# EAGLE design 8CH Dimmer (EAGLE 7.5.0)
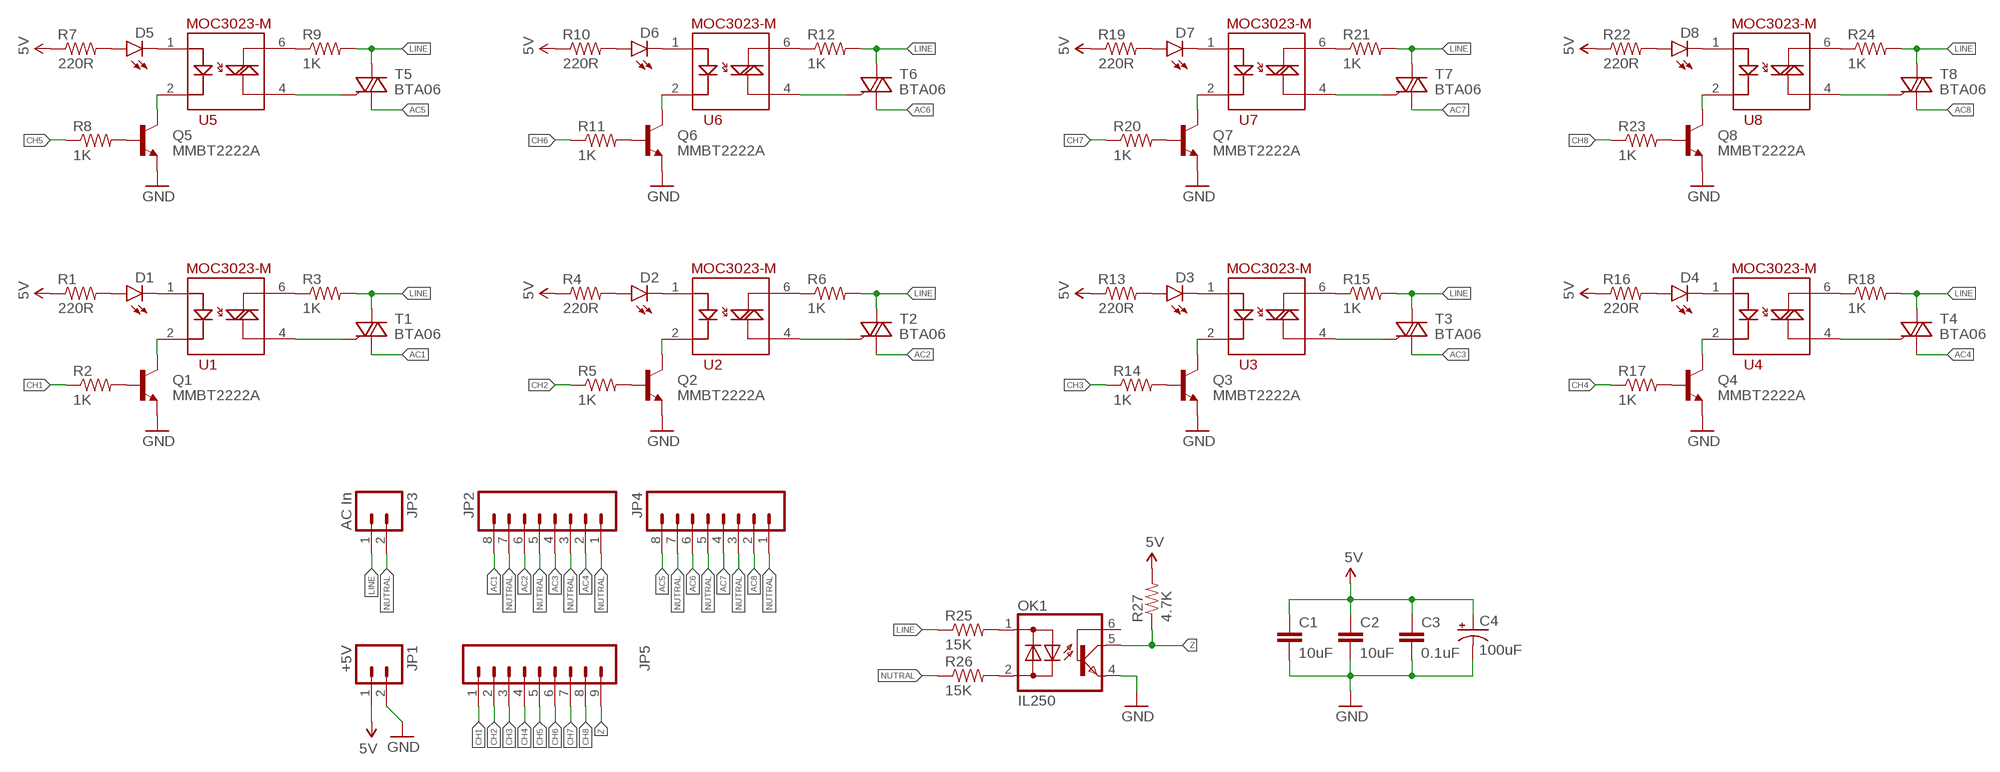
[diagram p0: schematic, sheet 1]

## Parts
C1  10uF  CAP0805  [0805]
C2  10uF  CAP0805  [0805]
C3  0.1uF  CAP0805  [0805]
C4  100uF  CPOL-USE2.5-5  [E2,5-5]
D1  LED3MM  [LED3MM]
D2  LED3MM  [LED3MM]
D3  LED3MM  [LED3MM]
D4  LED3MM  [LED3MM]
D5  LED3MM  [LED3MM]
D6  LED3MM  [LED3MM]
D7  LED3MM  [LED3MM]
D8  LED3MM  [LED3MM]
JP1  +5V  M023.5MM  [SCREWTERMINAL-3.5MM-2]
JP2  M083.5MM-8  [SCREWTERMINAL-3.5MM-8]
JP3  AC In  M023.5MM  [SCREWTERMINAL-3.5MM-2]
JP4  M083.5MM-8  [SCREWTERMINAL-3.5MM-8]
JP5  M09  [1X09]
OK1  IL250  [DIL06]
Q1  MMBT2222A  TRANSISTOR_NPNMMBT2222A  [SOT23-3]
Q2  MMBT2222A  TRANSISTOR_NPNMMBT2222A  [SOT23-3]
Q3  MMBT2222A  TRANSISTOR_NPNMMBT2222A  [SOT23-3]
Q4  MMBT2222A  TRANSISTOR_NPNMMBT2222A  [SOT23-3]
Q5  MMBT2222A  TRANSISTOR_NPNMMBT2222A  [SOT23-3]
Q6  MMBT2222A  TRANSISTOR_NPNMMBT2222A  [SOT23-3]
Q7  MMBT2222A  TRANSISTOR_NPNMMBT2222A  [SOT23-3]
Q8  MMBT2222A  TRANSISTOR_NPNMMBT2222A  [SOT23-3]
R1  220R  RESISTOR0805-RES  [0805]
R2  1K  RESISTOR0805-RES  [0805]
R3  1K  RESISTORPTH-1/2W  [AXIAL-0.5]
R4  220R  RESISTOR0805-RES  [0805]
R5  1K  RESISTOR0805-RES  [0805]
R6  1K  RESISTORPTH-1/2W  [AXIAL-0.5]
R7  220R  RESISTOR0805-RES  [0805]
R8  1K  RESISTOR0805-RES  [0805]
R9  1K  RESISTORPTH-1/2W  [AXIAL-0.5]
R10  220R  RESISTOR0805-RES  [0805]
R11  1K  RESISTOR0805-RES  [0805]
R12  1K  RESISTORPTH-1/2W  [AXIAL-0.5]
R13  220R  RESISTOR0805-RES  [0805]
R14  1K  RESISTOR0805-RES  [0805]
R15  1K  RESISTORPTH-1/2W  [AXIAL-0.5]
R16  220R  RESISTOR0805-RES  [0805]
R17  1K  RESISTOR0805-RES  [0805]
R18  1K  RESISTORPTH-1/2W  [AXIAL-0.5]
R19  220R  RESISTOR0805-RES  [0805]
R20  1K  RESISTOR0805-RES  [0805]
R21  1K  RESISTORPTH-1/2W  [AXIAL-0.5]
R22  220R  RESISTOR0805-RES  [0805]
R23  1K  RESISTOR0805-RES  [0805]
R24  1K  RESISTORPTH-1/2W  [AXIAL-0.5]
R25  15K  RESISTORPTH-1/2W  [AXIAL-0.5]
R26  15K  RESISTORPTH-1/2W  [AXIAL-0.5]
R27  4.7K  RESISTOR0805-RES  [0805]
T1  BTA06  [TO220-V]
T2  BTA06  [TO220-V]
T3  BTA06  [TO220-V]
T4  BTA06  [TO220-V]
T5  BTA06  [TO220-V]
T6  BTA06  [TO220-V]
T7  BTA06  [TO220-V]
T8  BTA06  [TO220-V]
U1  MOC3023-M  MOC3031-M  [DIL06]
U2  MOC3023-M  MOC3031-M  [DIL06]
U3  MOC3023-M  MOC3031-M  [DIL06]
U4  MOC3023-M  MOC3031-M  [DIL06]
U5  MOC3023-M  MOC3031-M  [DIL06]
U6  MOC3023-M  MOC3031-M  [DIL06]
U7  MOC3023-M  MOC3031-M  [DIL06]
U8  MOC3023-M  MOC3031-M  [DIL06]

## Nets
5V: C1.1 C2.1 C3.1 C4.+ JP1.1 R1.1 R4.1 R7.1 R10.1 R13.1 R16.1 R19.1 R22.1 R27.2
AC1: JP2.8 T1.1(A1)
AC2: JP2.6 T2.1(A1)
AC3: JP2.4 T3.1(A1)
AC4: JP2.2 T4.1(A1)
AC5: JP4.8 T5.1(A1)
AC6: JP4.6 T6.1(A1)
AC7: JP4.4 T7.1(A1)
AC8: JP4.2 T8.1(A1)
CH1: JP5.1 R2.1
CH2: JP5.2 R5.1
CH3: JP5.3 R14.1
CH4: JP5.4 R17.1
CH5: JP5.5 R8.1
CH6: JP5.6 R11.1
CH7: JP5.7 R20.1
CH8: JP5.8 R23.1
GND: C1.2 C2.2 C3.2 C4.- JP1.2 OK1.4(E) Q1.2(E) Q2.2(E) Q3.2(E) Q4.2(E) Q5.2(E) Q6.2(E) Q7.2(E) Q8.2(E)
LINE: JP3.1 R3.P$2 R6.P$2 R9.P$2 R12.P$2 R15.P$2 R18.P$2 R21.P$2 R24.P$2 R25.P$1 T1.2(A2) T2.2(A2) T3.2(A2) T4.2(A2) T5.2(A2) T6.2(A2) T7.2(A2) T8.2(A2)
N$1: D1.K(C) U1.1
N$2: D1.A R1.2
N$3: Q1.1(B) R2.2
N$4: T1.3(G) U1.4
N$5: Q1.3(C) U1.2
N$6: R3.P$1 U1.6
N$7: Q2.1(B) R5.2
N$8: T2.3(G) U2.4
N$9: R6.P$1 U2.6
N$10: Q2.3(C) U2.2
N$11: D2.K(C) U2.1
N$12: D2.A R4.2
N$13: Q5.1(B) R8.2
N$14: T5.3(G) U5.4
N$15: R9.P$1 U5.6
N$16: Q5.3(C) U5.2
N$17: D5.K(C) U5.1
N$18: D5.A R7.2
N$19: Q6.1(B) R11.2
N$20: T6.3(G) U6.4
N$21: R12.P$1 U6.6
N$22: Q6.3(C) U6.2
N$23: D6.K(C) U6.1
N$24: D6.A R10.2
N$25: Q3.1(B) R14.2
N$26: T3.3(G) U3.4
N$27: R15.P$1 U3.6
N$28: Q3.3(C) U3.2
N$29: D3.K(C) U3.1
N$30: D3.A R13.2
N$31: Q4.1(B) R17.2
N$32: T4.3(G) U4.4
N$33: R18.P$1 U4.6
N$34: Q4.3(C) U4.2
N$35: D4.K(C) U4.1
N$36: D4.A R16.2
N$37: Q7.1(B) R20.2
N$38: T7.3(G) U7.4
N$39: R21.P$1 U7.6
N$40: Q7.3(C) U7.2
N$41: D7.K(C) U7.1
N$42: D7.A R19.2
N$43: Q8.1(B) R23.2
N$44: T8.3(G) U8.4
N$45: R24.P$1 U8.6
N$46: Q8.3(C) U8.2
N$47: D8.K(C) U8.1
N$48: D8.A R22.2
N$49: OK1.1(AC1) R25.P$2
N$50: OK1.2(AC2) R26.P$2
NUTRAL: JP2.1 JP2.3 JP2.5 JP2.7 JP3.2 JP4.1 JP4.3 JP4.5 JP4.7 R26.P$1
Z: JP5.9 OK1.5(C) R27.1
Unconnected: OK1.6(B)

## Library data of the parts
C1-C3 = SparkFun-Capacitors:CAP: Capacitor Standard 0603 ceramic capacitor, and 0.1" leaded capacitor.
C4 = adafruit:CPOL-US: POLARIZED CAPACITOR, American symbol
D1-D8 = SparkFun-LED:LED: LEDs Standard schematic elements and footprints for 5mm, 3mm, 1206, and 0603 sized LEDs. 5mm - Spark Fun Electronics SKU : COM-00529 (and others)
JP1 JP3 = SparkFun-Connectors:M02: Standard 2-pin 0.1" header. Use with - straight break away headers ( PRT-00116) - right angle break away headers (PRT-00553) - swiss pins (PRT-00743) - machine pins (PRT-00117) - female headers (PRT-00115) Molex polarized connector foot print use with: PRT-08233 with associated crimp pins and housings. 2.54_SCREWTERM for use with PRT-10571. 3.5mm Screw Terminal footprints for PRT-08084 5mm Screw Terminal footprints for use with PRT-08432; PROD_ID: CONN-08399
JP2 JP4 = SparkFun-Connectors:M08: Header 8 Standard 8-pin 0.1" header. Use with straight break away headers (SKU : PRT-00116), right angle break away headers (PRT-00553), swiss pins (PRT-00743), machine pins (PRT-00117), and female headers (PRT-00115).
JP5 = SparkFun-Connectors:M09: Header 9 Standard 9-pin 0.1" header. Use with straight break away headers (SKU : PRT-00116), right angle break away headers (PRT-00553), swiss pins (PRT-00743), machine pins (PRT-00117), and female headers (PRT-00115).
OK1 = optocoupler:IL250: SIEMENS OPTO COUPLER; MF: VISHAY/TELEFUNKEN; MPN: IL250; OC_FARNELL: 1469559; OC_NEWARK: 58K1705
Q1-Q8 = SparkFun-DiscreteSemi:TRANSISTOR_NPN: Generic NPN BJT MMBT2222A - TRANS-08049 (SOT-23, 1A 40V) MPSA42 - TRANS-09116 (SOT-23, 500mA 300V) MMBT5088LT1G - TRANS-11160 (SOT-23, 50 mA 30V) BC547 - COM-08928 <http://www.sparkfun.com/products/8928> (TO-92 45V 100mA) (1.Collector 2.Base 3.Emitter) 2N3904 - COM-00521 <http://www.sparkfun.com/products/521> (TO-92 40V 200mA) (1.Emitter 2.Base 3.Collector) P2N2222A - COM-12852 <http://www.sparkfun.com/products/12852> (TO-92 40V 600mA) (1.Collector 2.Base 3.Emitter); PROD_ID: TRANS-08049
R1-R27 = SparkFun-Resistors:RESISTOR: Resistor Basic schematic elements and footprints for 0603, 1206, and PTH resistors.
T1-T8 = spaelectronics:BTA06
U1-U8 = SparkFun-DiscreteSemi:MOC3031-M: Opto-isolated TRIAC

## Board
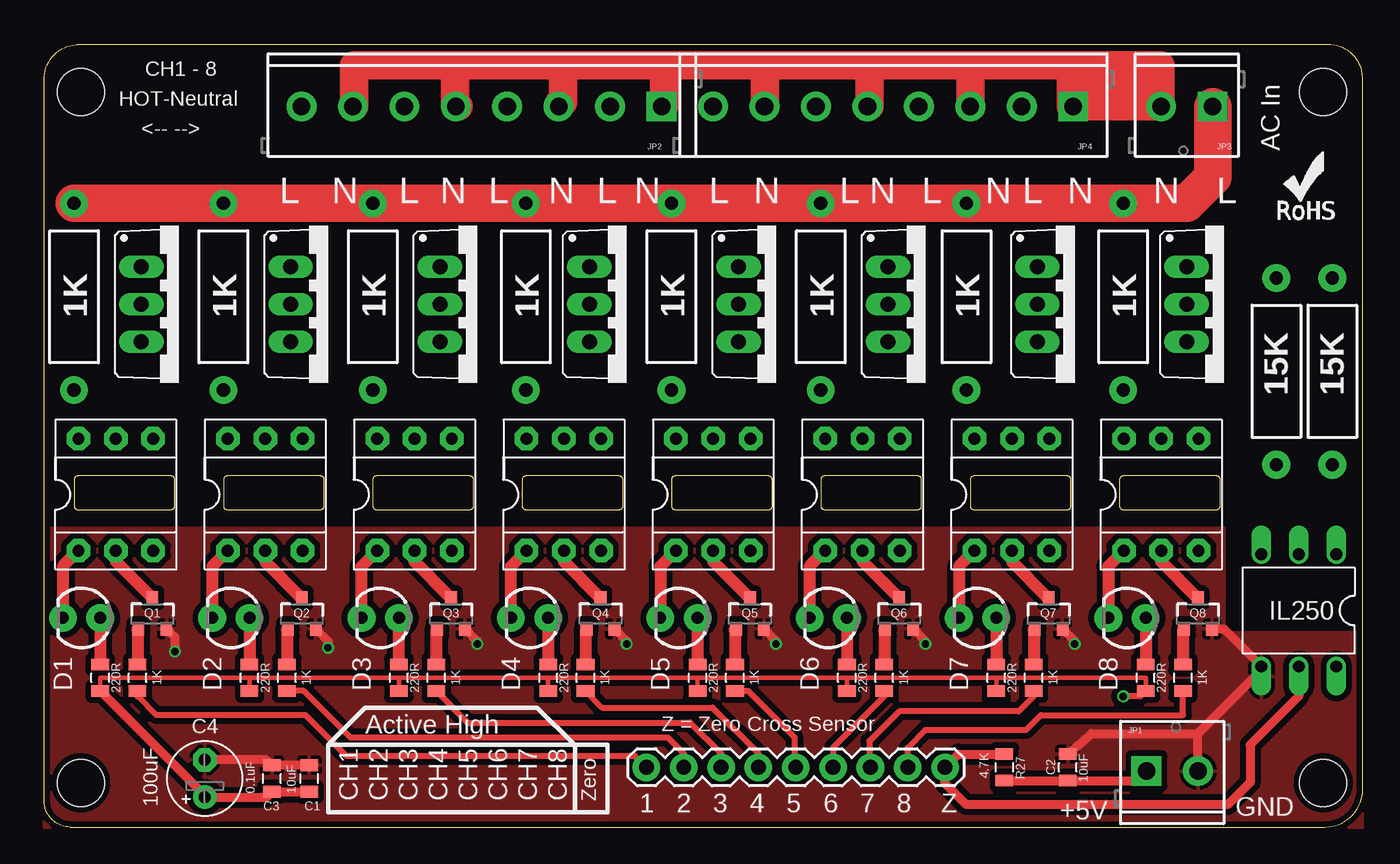
[diagram p1: board, top side]
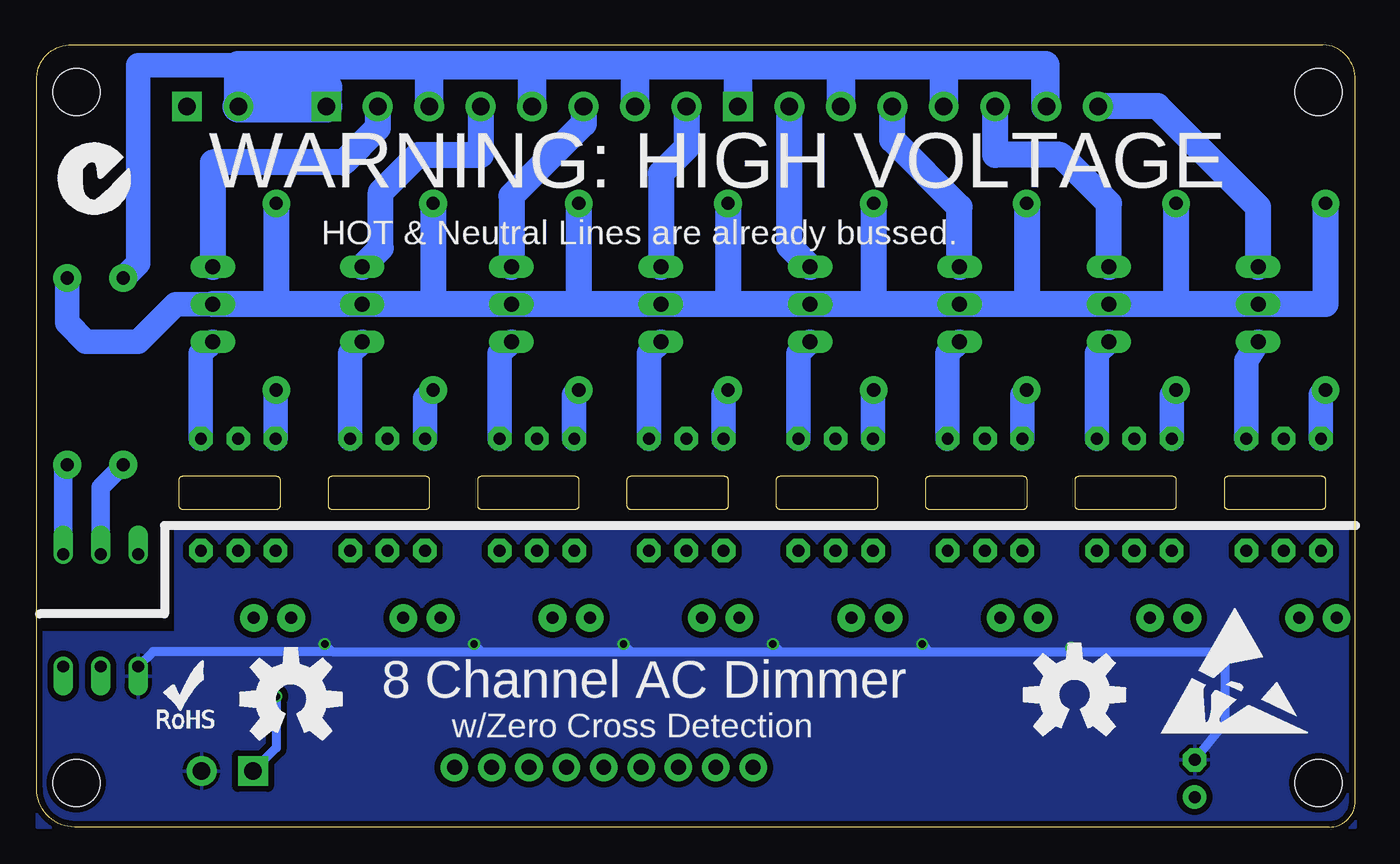
[diagram p2: board, bottom side, seen from below]

Size 89.7 x 53.2 mm. Coordinates in mm from the lower left corner, seen from the top.
Outline: 1.78,0 87.1,0 arc90 89.7,2.6 89.7,51 arc90 87.3,53.2 2.2,53.2 arc90 0,50.8 0,1.78 arc90 1.78,0
Copper layers (1*16): Top 0.035mm / dielectric 1.5mm / Bottom 0.035mm
Design rules "dirt_cheap_dirty_boards.v1": minimum track width 5mil, minimum drill 12mil, track to track 5mil, track to pad 5mil, pad to pad 5mil, via to via 5mil, smd to smd 0mil, copper to edge 10mil, drill to drill 10mil, minimum pad ring 10mil, minimum via ring 6mil, stop-mask expansion 2mil, vias tented up to drill 25mil, thermal gap 10mil
Holes 3.2 mm at 2.5,3 2.5,50 87,50 87,3
Milling: 64 lines

### Footprints (pad centres in the part's own frame; a part is rotated, then mirrored left to right if it is on the bottom)
0805 = smd 0.8 x 1.2: 1 -0.9,0; 2 0.9,0
E2,5-5 = drill 0.813 pad 1.6: + -1.27,0 | drill 0.813 pad 1.6 octagon: - 1.27,0
LED3MM = drill 0.813 pad 1.88: A -1.27,0; K 1.27,0
SCREWTERMINAL-3.5MM-2 = drill 1.2 pad 2.032 square: 1 0,0 | drill 1.2 pad 2.032: 2 3.5,0
SCREWTERMINAL-3.5MM-8 = drill 1.2 pad 2.032 square: 1 0,0 | drill 1.2 pad 2.032: 2 3.5,0; 3 7,0; 4 10.5,0; 5 14,0; 6 17.5,0; 7 21,0; 8 24.5,0
1X09 = drill 1.016 pad 1.88: 1 0,0; 2 2.54,0; 3 5.08,0; 4 7.62,0; 5 10.16,0; 6 12.7,0; 7 15.24,0; 8 17.78,0; 9 20.32,0
DIL06 = drill 0.813 offset: 1 -2.54,-3.81; 2 0,-3.81; 3 2.54,-3.81; 4 2.54,3.81; 5 0,3.81; 6 -2.54,3.81
SOT23-3 = smd 0.8 x 0.9: 1 -0.95,-1; 2 0.95,-1; 3 0,1.1
AXIAL-0.5 = drill 0.9 pad 1.88: P$1 -6.35,0; P$2 6.35,0
TO220-V = drill 1.016 long: 1 -2.54,0; 2 0,0; 3 2.54,0
DIL06' = drill 0.813 pad 1.6 octagon: 1 -3.51,-3.81; 2 -0.97,-3.81; 3 1.57,-3.81; 4 1.57,3.81; 5 -0.97,3.81; 6 -3.51,3.81

### Placement (x,y rotation side)
C1  18.03,3.3 90 top
C2  69.63,4.06 90 top
C3  15.49,3.3 90 top
C4  10.92,3.3 90 top
D1  2.54,14.22 180 top
D2  12.7,14.22 180 top
D3  22.86,14.22 180 top
D4  33.02,14.22 180 top
D5  43.18,14.22 180 top
D6  53.34,14.22 180 top
D7  63.5,14.22 180 top
D8  73.66,14.22 180 top
JP1  74.99,3.81 0 top
JP2  42,49 180 top
JP3  79.48,49 180 top
JP4  70,49 180 top
JP5  40.97,4.06 0 top
OK1  85.34,14.73 180 top
Q1  7.37,14.48 0 top
Q2  17.53,14.48 0 top
Q3  27.69,14.48 0 top
Q4  37.85,14.48 0 top
Q5  48.01,14.48 0 top
Q6  58.17,14.48 0 top
Q7  68.33,14.48 0 top
Q8  78.49,14.48 0 top
R1  3.81,10.16 90 top
R2  6.35,10.16 90 top
R3  2.03,36.07 90 top
R4  13.97,10.16 90 top
R5  16.51,10.16 90 top
R6  12.19,36.07 90 top
R7  44.45,10.16 90 top
R8  46.99,10.16 90 top
R9  42.67,36.07 90 top
R10  54.61,10.16 90 top
R11  57.15,10.16 90 top
R12  52.83,36.07 90 top
R13  24.13,10.16 90 top
R14  26.67,10.16 90 top
R15  22.35,36.07 90 top
R16  34.29,10.16 90 top
R17  36.83,10.16 90 top
R18  32.77,36.07 90 top
R19  64.77,10.16 90 top
R20  67.31,10.16 90 top
R21  62.74,36.07 90 top
R22  74.93,10.16 90 top
R23  77.47,10.16 90 top
R24  73.41,36.07 90 top
R25  87.63,30.99 270 top
R26  83.82,30.99 270 top
R27  65.31,4.06 270 top
T1  6.6,35.56 270 top
T2  16.76,35.56 270 top
T3  26.92,35.56 270 top
T4  37.08,35.56 270 top
T5  47.24,35.56 270 top
T6  57.4,35.56 270 top
T7  67.56,35.56 270 top
T8  77.72,35.56 270 top
U1  MOC3023-M  [DIL06']  5.84,22.61 0 top
U2  MOC3023-M  [DIL06']  16,22.61 0 top
U3  MOC3023-M  [DIL06']  26.16,22.61 0 top
U4  MOC3023-M  [DIL06']  36.32,22.61 0 top
U5  MOC3023-M  [DIL06']  46.48,22.61 0 top
U6  MOC3023-M  [DIL06']  56.64,22.61 0 top
U7  MOC3023-M  [DIL06']  66.8,22.61 0 top
U8  MOC3023-M  [DIL06']  76.96,22.61 0 top
U$1  [OSHW-LOGO-L]  72.4,8.7 0 bottom
U$2  [OSHW-LOGO-L]  19.1,9 0 bottom
U$3  [ROHS_LOGO_0.18_IN]  83.7,41.2 0 top
U$4  [ROHS_LOGO_0.18_IN]  81.7,6.6 0 bottom
U$5  [C_TICK-5MM]  88.3,41.6 0 bottom
U$6  [ESD_10.00]  13.3,6.3 0 bottom

### Tracks (layer width: path | path; a pad name or v marks a point on that pad's centre or on a via)
5V  (via drill 0.5)
  Top 0.305: R1.1 3.81,10.16 13.97,10.16 | 13.97,10.16 24.13,10.16 | 24.13,10.16 34.29,10.16 | 34.29,10.16 44.45,10.16 | 44.45,10.16 54.61,10.16 | 54.61,10.16 64.77,10.16 | 64.77,10.16 74.93,10.16 R22.1 | R19.1 64.77,10.16 | R10.1 54.61,10.16 | R7.1 44.45,10.16 | R16.1 34.29,10.16 | R13.1 24.13,10.16 | R4.1 13.97,10.16
  Top 0.406: R22.1 74.56,8.89 v73.41,8.89 | C4.+ 11.04,2.03
  Top 0.61: 3.81,9.14 R1.1 11.04,2.03 | R27.2 C2.1 74.34,3.16 JP1.1 | C4.+ 15.12,2.03 C3.1 C1.1
  Bottom 0.61: v73.41,8.89 73.41,5.39 JP1.1
AC1
  Bottom 1.778: T1.1 6.6,42.16 13.46,49.02 17.48,49.02 JP2.8
AC2
  Bottom 1.778: T2.1 16.76,42.42 20.07,45.72 24.5,45.72 JP2.6
AC3
  Bottom 1.676: JP2.4
  Bottom 1.778: T3.1 26.92,42.16 31.5,46.74 JP2.4
AC4
  Bottom 1.778: T4.1 38.5,39.52 JP2.2
AC5
  Bottom 1.778: JP4.8 45.5,46.19 47.24,44.45 T5.1
AC6
  Bottom 1.778: JP4.6 52.5,47.83 57.4,42.93 T6.1
AC7
  Bottom 1.778: JP4.4 59.5,45.72 63.75,45.72 66.29,43.18 66.29,39.37 T7.1
AC8
  Bottom 1.778: JP4.2 66.5,47.55 68.83,45.21 77.72,45.21 T8.1
CH1
  Top 0.406: JP5.1 40.2,4.83 20.57,4.83 17.78,7.62 7.62,7.62 6.35,8.89 R2.1
CH2
  Top 0.406: R5.1 17.66,9.26 20.83,6.1 42.42,6.1 43.51,5.01 JP5.2
CH3
  Top 0.406: JP5.3 46.05,5.01 43.94,7.11 28.82,7.11 R14.1
CH4
  Top 0.406: R17.1 37.96,8.13 45.47,8.13 48.59,5.01 JP5.4
CH5
  Top 0.406: R8.1 47.89,9.26 51.05,6.1 51.05,4.14
  Top 0.61: 51.05,4.14 JP5.5
CH6
  Top 0.406: R11.1 57.15,8.89 53.67,5.41 JP5.6
CH7
  Top 0.406: R20.1 67.31,8.89 66.29,7.87 58.17,7.87 56.13,5.84 56.13,4.14
  Top 0.61: 56.13,4.14 JP5.7
CH8
  Top 0.406: JP5.8 58.75,5.41 59.94,6.6 66.8,6.6 67.82,7.62 77.47,7.62 R23.1
GND  (via drill 0.5)
  Top 0.61: Q8.2 80.25,13.48 OK1.4 82.8,10.67 78.49,6.35 | JP1.2 78.49,6.35 | C2.2 71.27,6.35 78.49,6.35 | Q1.2 8.89,12.9 v8.89,11.94 | Q2.2 19.3,12.65 v19.3,12.19 | Q3.2 29.46,12.65 v29.46,12.45 | Q4.2 39.62,12.65 v39.62,12.45 | Q5.2 49.78,12.65 v49.78,12.45 | Q6.2 59.94,12.65 v59.94,12.45 | Q7.2 70.1,12.65 v70.1,12.45 | C1.2 C3.2 15.12,4.57 C4.-
  Bottom 0.61: v19.3,12.19 19.05,11.94 | 19.05,11.94 v8.89,11.94 8.89,7.11 C4.- | v29.46,12.45 28.96,11.94 | v39.62,12.45 39.12,11.94 | 39.12,11.94 28.96,11.94 | 28.96,11.94 19.05,11.94 | v49.78,12.45 49.28,11.94 | 49.28,11.94 39.12,11.94 | v59.94,12.45 59.44,11.94 | 59.44,11.94 49.28,11.94 | v70.1,12.45 69.6,11.94 | 69.6,11.94 59.44,11.94 | 69.6,11.94 81.79,11.94 OK1.4
  pour Bottom (isolate 0.406): 0,0 89.66,0 89.66,13.21 80.26,13.21 80.26,20.32 0,20.32
  pour Top (isolate 0.406): 0,0 89.66,0 89.66,13.21 80.26,13.21 80.26,20.32 0,20.32
LINE
  Top 1.778: 73.66,42.42 R24.P$2
  Top 2.54: JP3.1 79.48,44.18 77.72,42.42 73.66,42.42 R21.P$2 R12.P$2 R9.P$2 R18.P$2 R15.P$2 R6.P$2 R3.P$2
  Bottom 1.676: T8.2 80.26,35.56 82.8,33.02 86.36,33.02 87.63,34.29 R25.P$1
  Bottom 1.778: 12.19,35.56 T1.2 2.03,35.56 R3.P$2 | 12.19,35.56 T2.2 22.35,35.56 | 22.35,35.56 T3.2 32.77,35.56 | 32.77,35.56 T4.2 42.67,35.56 | 42.67,35.56 T5.2 52.83,35.56 | 52.83,35.56 T6.2 62.74,35.56 | 62.74,35.56 T7.2 73.41,35.56 | 73.41,35.56 T8.2 | R6.P$2 12.19,35.56 | R15.P$2 22.35,35.56 | R18.P$2 32.77,35.56 | R9.P$2 42.67,35.56 | R12.P$2 52.83,35.56 | R21.P$2 62.74,35.56 | R24.P$2 73.41,35.56
N$1
  Top 0.813: U1.1 1.27,17.73 D1.K
N$2
  Top 0.813: D1.A R1.2
N$3
  Top 0.813: Q1.1 6.35,13.41 R2.2
N$4
  Bottom 1.676: T1.3 7.41,31.7 U1.4
N$5
  Top 0.813: Q1.3 4.87,18.07 U1.2
N$6
  Bottom 1.676: R3.P$1 2.33,29.42 U1.6
N$7
  Top 0.813: Q2.1 16.51,13.41 R5.2
N$8
  Bottom 1.676: T2.3 17.57,32.21 U2.4
N$9
  Bottom 1.676: R6.P$1 12.49,29.42 U2.6
N$10
  Top 0.813: Q2.3 15.03,18.07 U2.2
N$11
  Top 0.813: U2.1 11.43,17.73 D2.K
N$12
  Top 0.813: D2.A R4.2
N$13
  Top 0.813: Q5.1 46.99,13.41 R8.2
N$14
  Bottom 1.676: T5.3 48.05,32.21 U5.4
N$15
  Bottom 1.676: R9.P$1 42.97,29.42 U5.6
N$16
  Top 0.813: Q5.3 45.51,18.07 U5.2
N$17
  Top 0.813: U5.1 41.91,17.73 D5.K
N$18
  Top 0.813: D5.A R7.2
N$19
  Top 0.813: Q6.1 57.15,13.41 R11.2
N$20
  Bottom 1.676: T6.3 58.21,32.21 U6.4
N$21
  Bottom 1.676: R12.P$1 53.13,29.42 U6.6
N$22
  Top 0.813: Q6.3 55.67,18.07 U6.2
N$23
  Top 0.813: U6.1 52.07,17.73 D6.K
N$24
  Top 0.813: D6.A R10.2
N$25
  Top 0.813: Q3.1 26.67,13.41 R14.2
N$26
  Bottom 1.676: T3.3 27.73,32.21 U3.4
N$27
  Bottom 1.676: R15.P$1 22.65,29.42 U3.6
N$28
  Top 0.813: Q3.3 25.19,18.07 U3.2
N$29
  Top 0.813: D3.K 21.59,17.73 U3.1
N$30
  Top 0.813: R13.2 D3.A
N$31
  Top 0.813: Q4.1 36.83,13.41 R17.2
N$32
  Bottom 1.676: T4.3 37.89,32.21 U4.4
N$33
  Bottom 1.676: R18.P$1 32.81,29.67 U4.6
N$34
  Top 0.813: Q4.3 35.35,18.07 U4.2
N$35
  Top 0.813: D4.K 31.75,17.73 U4.1
N$36
  Top 0.813: D4.A R16.2
N$37
  Top 0.813: Q7.1 67.31,13.41 R20.2
N$38
  Bottom 1.676: T7.3 68.37,32.21 U7.4
N$39
  Bottom 1.676: R21.P$1 63.29,29.16 U7.6
N$40
  Top 0.813: Q7.3 65.83,18.07 U7.2
N$41
  Top 0.813: U7.1 62.23,17.73 D7.K
N$42
  Top 0.813: D7.A R19.2
N$43
  Top 0.813: Q8.1 77.47,13.41 R23.2
N$44
  Bottom 1.676: T8.3 78.53,32.21 U8.4
N$45
  Bottom 1.676: R24.P$1 73.45,29.67 U8.6
N$46
  Top 0.813: Q8.3 75.99,18.07 U8.2
N$47
  Top 0.813: U8.1 72.39,17.73 D8.K
N$48
  Top 0.813: D8.A R22.2
N$49
  Bottom 1.27: R25.P$2 87.88,24.38 OK1.1
N$50
  Bottom 1.27: R26.P$2 85.34,23.11 OK1.2
N$51
  Top 1.93: 69.85,51.82 69.85,49.02 75.95,49.02 75.95,50.29 | 69.85,51.82 70.36,51.82 | 70.36,51.82 75.95,51.82 75.95,50.29 | 75.95,50.29 71.37,50.29 71.37,50.55 70.36,50.55 70.36,51.82 | 69.85,51.82 35.31,51.82 | 35.31,51.82 21.08,51.82 21.08,49.02 | 35.05,49.28 35.31,49.28 35.31,51.82
N$52
  Top 1.93: 28.19,49.02 27.94,49.02 27.94,51.56
N$53
  Top 1.93: 42.16,49.02 42.16,51.56
N$54
  Top 1.93: 49.02,49.02 49.02,51.05
N$55
  Top 1.93: 56.13,49.02 56.13,51.56
N$56
  Top 1.93: 62.99,49.02 62.99,51.56
NUTRAL
  Bottom 1.676: R26.P$1 82.8,38.35 82.8,51.82 74.93,51.82
  Bottom 1.93: JP3.2 75.98,51.82 74.93,51.82 63,51.82 | 63,51.82 56,51.82 | 56,51.82 49,51.82 | 49,51.82 42,51.82 | 42,51.82 35,51.82 | 35,51.82 28,51.82 | 28,51.82 21.08,51.82 21.08,49 JP2.7 | JP2.5 28,51.82 | JP2.3 35,51.82 | JP2.1 42,51.82 | JP4.7 49,51.82 | JP4.5 56,51.82 | JP4.3 63,51.82
  Bottom 2.184: JP4.1 70,50.29 75.44,50.29 75.44,49.02 70.1,49.02 70.1,49 JP3.2
Z
  Top 0.61: R27.1 62.19,4.96 JP5.9 61.29,2.98 62.74,1.52 80.52,1.52 82.04,3.05 82.04,5.59 85.34,8.89 OK1.5

### Text on the board
tNames: CH1 - 8 | HOT-Neutral | <-- --> | L | N | L | N | L | N | L | N | L | N | L | N | L | N | L | N | N | L | Active High | Z = Zero Cross Sensor | CH1 | CH2 | CH3 | CH4 | CH5 | CH6 | CH7 | CH8 | Zero | 1 | 2 | 3 | 4 | 5 | 6 | 7 | 8 | Z | GND
bNames: WARNING: HIGH VOLTAGE | HOT & Neutral Lines are already bussed. | 8 Channel AC Dimmer | w/Zero Cross Detection